# Altium schematic sheet Schematic1_1核心板.schdoc (part 2 of 3)
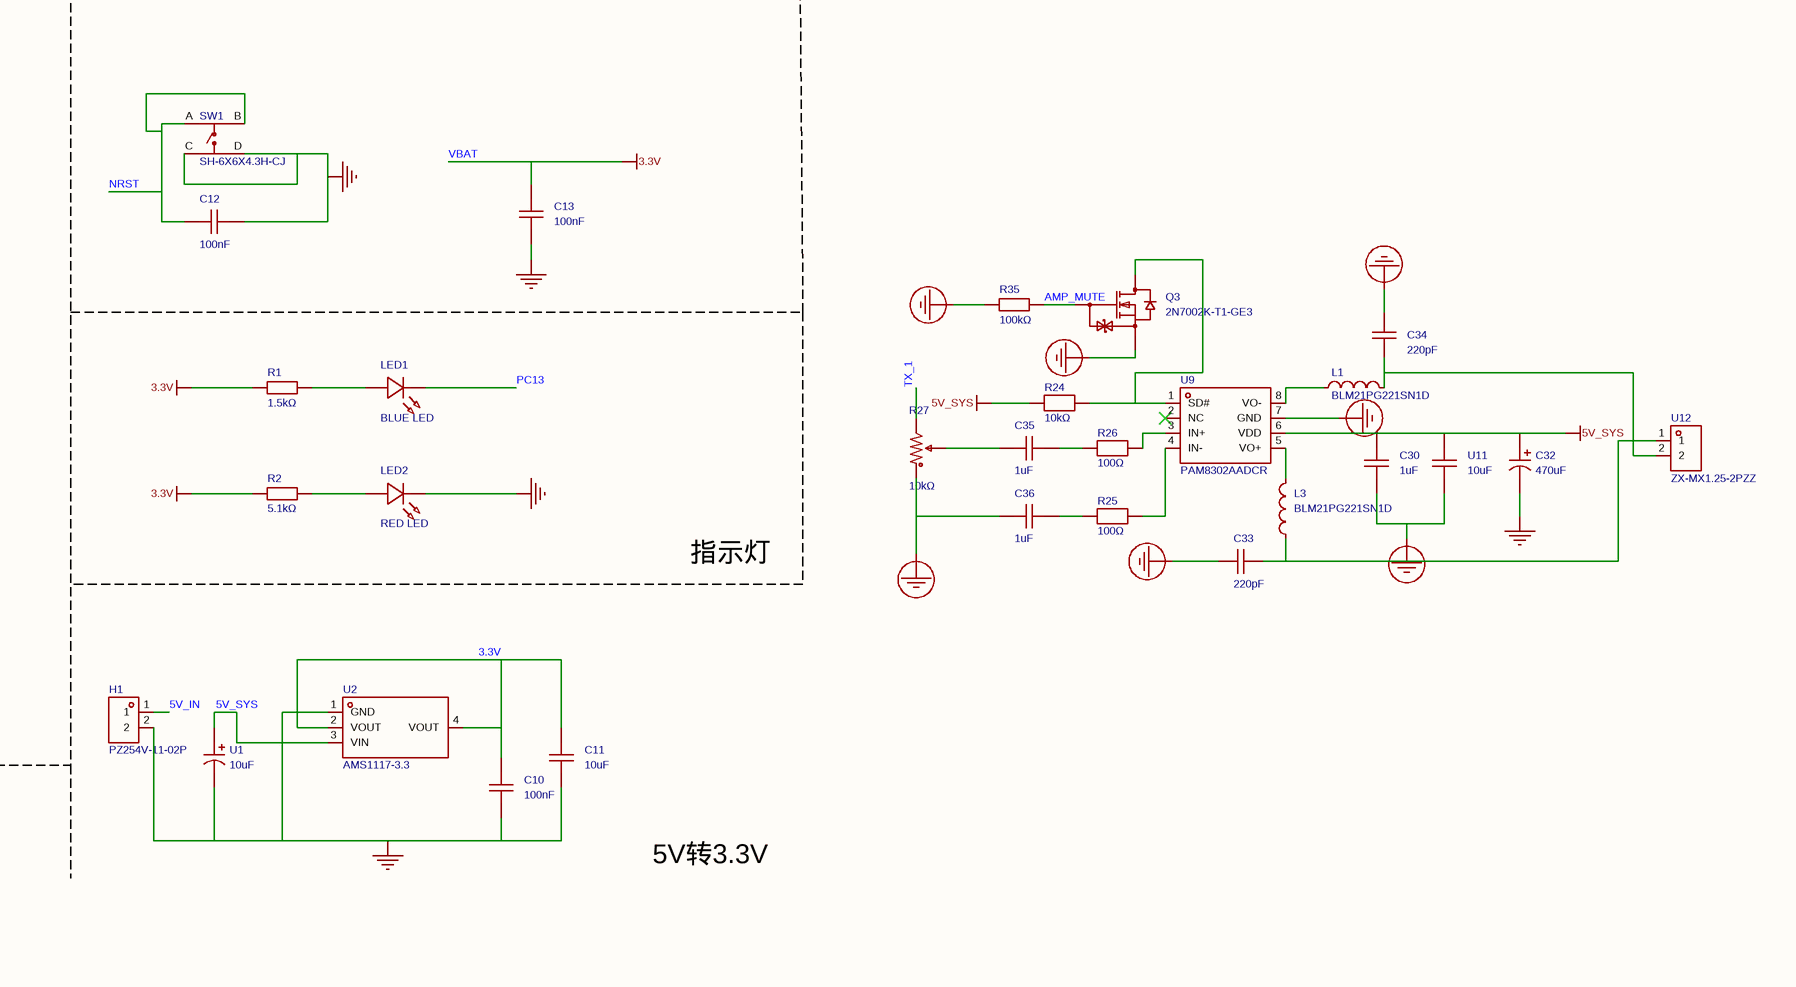
[diagram p4: Schematic1_1核心板.schdoc, bottom right]
## Library data of the parts
C0 C20 = CL21A475KAQNNNE: 容值:4.7uF;精度:±10%;额定电压:25V;温度系数:X5R;; Manufacturer: SAMSUNG(三星); AddInBom: yes; ModelId: 1ba041120af144c991958decab20d2410819f05c4eef4c71ace90d822a990e87; ModelName: C0805_L2.0-W1.3-H1.3; ModelTransform: 78.74,51.181,0,0,0,0,0,0.0005,0; Tolerance: ±10%; Voltage Rating: 25V; Temperature Coefficient: X5R; Symbol: CL21A475KAQNNNE; Device: CL21A475KAQNNNE; LCSC Part Name: 4.7uF ±10% 25V; SupplierPart: C1779; ManufacturerPart: CL21A475KAQNNNE; Supplier Footprint: 0805; JLCPCB Part Class: Basic Part; Datasheet: https://item.szlcsc.com/datasheet/CL21A475KAQNNNE/2131.html; Supplier: LCSC; ConvertToPcb: yes; FootprintName: C0805; Value: 4.7uF
C1 C2 = 0603CG8R0C500NT: 容值:8pF;额定电压:50V;温度系数:C0G;; Manufacturer: FH(风华); Symbol: 0603CG8R0C500NT_C36508; AddInBom: yes; ModelId: ac125912035d415993ca9572d50418b10819f05c4eef4c71ace90d822a990e87; ModelName: C0603_L1.6-W0.8-H0.8; ModelTransform: 62.992,31.496,0,0,0,0,0,0,0; Voltage Rating: 50V; Temperature Coefficient: C0G; Device: 0603CG8R0C500NT; LCSC Part Name: ±0.25pF 8pF 50V; SupplierPart: C36508; ManufacturerPart: 0603CG8R0C500NT; Supplier Footprint: 0603; JLCPCB Part Class: Extended Part; Datasheet: https://item.szlcsc.com/datasheet/0603CG8R0C500NT/37486.html; Supplier: LCSC; ConvertToPcb: yes; FootprintName: C0603; Value: 8pF
C3 = TAJB107K006RNJ: 容值:100uF;精度:±10%;额定电压:6.3V;等效串联电阻(ESR):1.7Ω@100kHz;; Manufacturer: Kyocera AVX; AddInBom: yes; ModelId: b77bd53aeda446d2bdd09b0fdaf9418a0819f05c4eef4c71ace90d822a990e87; ModelName: CASE-B_L3.5-W2.8-H1.9; ModelTransform: 145.669,110.236,0,0,0,0,0,0,0; Tolerance: ±10%; Voltage Rating: 6.3V; Symbol: TAJB107K006RNJ; Device: TAJB107K006RNJ; LCSC Part Name: 100uF ±10% 6.3V; SupplierPart: C16133; ManufacturerPart: TAJB107K006RNJ; Supplier Footprint: CASE-B-3528-21(mm); JLCPCB Part Class: Basic Part; Supplier: LCSC; ConvertToPcb: yes; FootprintName: CASE-B_3528; Value: 100uF; Equivalent Series Resistance(ESR): 1.7Ω@100kHz; Operating Temperature: -55℃~+125℃
C4-C7 C10 C12 C13 = CL21B104KBCNNNC: 容值:100nF;精度:±10%;额定电压:50V;温度系数:X7R;; Manufacturer: SAMSUNG(三星); AddInBom: yes; ModelId: 1ba041120af144c991958decab20d2410819f05c4eef4c71ace90d822a990e87; ModelName: C0805_L2.0-W1.3-H1.3; ModelTransform: 78.74,51.181,0,0,0,0,0,0.0005,0; Tolerance: ±10%; Voltage Rating: 50V; Temperature Coefficient: X7R; Symbol: CL21B104KBCNNNC; Device: CL21B104KBCNNNC; LCSC Part Name: 100nF ±10% 50V; SupplierPart: C1711; ManufacturerPart: CL21B104KBCNNNC; Supplier Footprint: 0805; JLCPCB Part Class: Extended Part; Datasheet: https://item.szlcsc.com/datasheet/CL21B104KBCNNNC/2063.html; Supplier: LCSC; ConvertToPcb: yes; FootprintName: C0805; Value: 100nF
C8 = CL21B105KAFNNNE: 容值:1uF;精度:±10%;额定电压:25V;温度系数:X7R;; Manufacturer: SAMSUNG(三星); AddInBom: yes; ModelId: 1ba041120af144c991958decab20d2410819f05c4eef4c71ace90d822a990e87; ModelName: C0805_L2.0-W1.3-H1.3; ModelTransform: 78.74,51.181,0,0,0,0,0,0.0005,0; Tolerance: ±10%; Voltage Rating: 25V; Temperature Coefficient: X7R; Symbol: CL21B105KAFNNNE; Device: CL21B105KAFNNNE; LCSC Part Name: 1uF ±10% 25V; SupplierPart: C116352; ManufacturerPart: CL21B105KAFNNNE; Supplier Footprint: 0805; JLCPCB Part Class: Extended Part; Datasheet: https://item.szlcsc.com/datasheet/CL21B105KAFNNNE/117606.html; Supplier: LCSC; ConvertToPcb: yes; FootprintName: C0805; Value: 1uF
C9 C21 = CL21B104KBCNNNC: 容值:100nF;精度:±10%;额定电压:50V;温度系数:X7R;; Manufacturer: SAMSUNG(三星); 3D Model: 1ba041120af144c991958decab20d2410819f05c4eef4c71ace90d822a990e87; 3D Model Transform: 78.74,51.181,0,0,0,0,0,0.0005,0; Tolerance: ±10%; Voltage Rating: 50V; Temperature Coefficient: X7R; AddInBom: yes; ModelName: C0805_L2.0-W1.3-H1.3; Symbol: CL21B104KBCNNNC; Device: CL21B104KBCNNNC; LCSC Part Name: 100nF ±10% 50V; Supplier Part: C1711; Manufacturer Part: CL21B104KBCNNNC; Supplier Footprint: 0805; JLCPCB Part Class: Extended Part; Datasheet: https://item.szlcsc.com/datasheet/CL21B104KBCNNNC/2063.html; Supplier: LCSC; Value: 100nF; ConvertToPcb: yes; FootprintName: C0805
C11 = CGA0805X5R106K500MT: 容值:10uF;精度:±10%;额定电压:50V;温度系数:X5R;; Manufacturer: HRE(芯声); AddInBom: yes; ModelId: 1ba041120af144c991958decab20d2410819f05c4eef4c71ace90d822a990e87; ModelName: C0805_L2.0-W1.3-H1.3; ModelTransform: 78.74,51.181,0,0,0,0,0,0.0005,0; Tolerance: ±10%; Voltage Rating: 50V; Temperature Coefficient: X5R; Symbol: CGA0805X5R106K500MT; Device: CGA0805X5R106K500MT; LCSC Part Name: 10uF ±10% 50V; SupplierPart: C6119889; ManufacturerPart: CGA0805X5R106K500MT; Supplier Footprint: 0805; JLCPCB Part Class: Extended Part; Datasheet: https://item.szlcsc.com/datasheet/CGA0805X5R106K500MT/7062595.html; Supplier: LCSC; ConvertToPcb: yes; FootprintName: C0805; Value: 10uF
C14 = CGA0805X7R105K500MT: 容值:1uF;精度:±10%;额定电压:50V;温度系数:X7R;; Manufacturer: HRE(芯声); AddInBom: yes; ModelId: 1ba041120af144c991958decab20d2410819f05c4eef4c71ace90d822a990e87; ModelName: C0805_L2.0-W1.3-H1.3; ModelTransform: 78.74,51.181,0,0,0,0,0,0.0005,0; Tolerance: ±10%; Voltage Rating: 50V; Temperature Coefficient: X7R; Symbol: CGA0805X7R105K500MT; Device: CGA0805X7R105K500MT; LCSC Part Name: 1uF ±10% 50V; SupplierPart: C6119929; ManufacturerPart: CGA0805X7R105K500MT; Supplier Footprint: 0805; JLCPCB Part Class: Extended Part; Datasheet: https://item.szlcsc.com/datasheet/CGA0805X7R105K500MT/7062635.html; Supplier: LCSC; ConvertToPcb: yes; FootprintName: C0805; Value: 1uF
C17 C24 C30 C35 C36 C40 = CGA0805X7R105K500MT: 容值:1uF;精度:±10%;额定电压:50V;温度系数:X7R;; Manufacturer: HRE(芯声); 3D Model: 1ba041120af144c991958decab20d2410819f05c4eef4c71ace90d822a990e87; 3D Model Transform: 78.74,51.181,0,0,0,0,0,0.0005,0; Tolerance: ±10%; Voltage Rating: 50V; Temperature Coefficient: X7R; AddInBom: yes; ModelName: C0805_L2.0-W1.3-H1.3; Symbol: CGA0805X7R105K500MT; Device: CGA0805X7R105K500MT; LCSC Part Name: 1uF ±10% 50V; Manufacturer Part: CGA0805X7R105K500MT; Supplier Footprint: 0805; JLCPCB Part Class: Extended Part; Datasheet: https://item.szlcsc.com/datasheet/CGA0805X7R105K500MT/7062635.html; Supplier: LCSC; ConvertToPcb: yes; FootprintName: C0805
  C17 C30 C35 C36 C40: Supplier Part: C6119929; Value: 1uF
  C24: Value: 2.2uF
C18 C19 C25 C26 C29 = TCC0805X7R104K500DT: 容值:100nF;精度:±10%;额定电压:50V;温度系数:X7R;; Manufacturer: CCTC(三环); AddInBom: yes; ModelId: 1ba041120af144c991958decab20d2410819f05c4eef4c71ace90d822a990e87; ModelName: C0805_L2.0-W1.3-H1.3; ModelTransform: 78.74,51.181,0,0,0,0,0,0.0005,0; Tolerance: ±10%; Voltage Rating: 50V; Temperature Coefficient: X7R; Symbol: TCC0805X7R104K500DT; Device: TCC0805X7R104K500DT; LCSC Part Name: 100nF ±10% 50V; SupplierPart: C282732; ManufacturerPart: TCC0805X7R104K500DT; Supplier Footprint: 0805; JLCPCB Part Class: Extended Part; Datasheet: https://item.szlcsc.com/datasheet/TCC0805X7R104K500DT/268703.html; Supplier: LCSC; ConvertToPcb: yes; FootprintName: C0805; Value: 100nF
C22 = CL21C222JBFNNNE: 容值:2.2nF;精度:±5%;额定电压:50V;温度系数:C0G;; Manufacturer: SAMSUNG(三星); AddInBom: yes; ModelId: 1ba041120af144c991958decab20d2410819f05c4eef4c71ace90d822a990e87; ModelName: C0805_L2.0-W1.3-H1.3; ModelTransform: 78.74,51.181,0,0,0,0,0,0.0005,0; Tolerance: ±5%; Voltage Rating: 50V; Temperature Coefficient: C0G; Symbol: CL21C222JBFNNNE; Device: CL21C222JBFNNNE; LCSC Part Name: 2.2nF ±5% 50V; SupplierPart: C28260; ManufacturerPart: CL21C222JBFNNNE; Supplier Footprint: 0805; JLCPCB Part Class: Basic Part; Datasheet: https://item.szlcsc.com/datasheet/CL21C222JBFNNNE/29010.html; Supplier: LCSC; ConvertToPcb: yes; FootprintName: C0805; Value: 2.2nF
C23 = CC0805KRX7R9BB102: 容值:1nF;精度:±10%;额定电压:50V;温度系数:X7R;; Manufacturer: YAGEO(国巨); AddInBom: yes; ModelId: 1ba041120af144c991958decab20d2410819f05c4eef4c71ace90d822a990e87; ModelName: C0805_L2.0-W1.3-H1.3; ModelTransform: 78.74,51.181,0,0,0,0,0,0.0005,0; Tolerance: ±10%; Voltage Rating: 50V; Temperature Coefficient: X7R; Symbol: CC0805KRX7R9BB102; Device: CC0805KRX7R9BB102; LCSC Part Name: 1nF ±10% 50V; SupplierPart: C94121; ManufacturerPart: CC0805KRX7R9BB102; Supplier Footprint: 0805; JLCPCB Part Class: Extended Part; Datasheet: https://item.szlcsc.com/datasheet/CC0805KRX7R9BB102/95319.html; Supplier: LCSC; ConvertToPcb: yes; FootprintName: C0805; Value: 1nF
C27 = CL21B225KAFNNNE: 容值:2.2uF;精度:±10%;额定电压:25V;温度系数:X7R;; Manufacturer: SAMSUNG(三星); AddInBom: yes; ModelId: 1ba041120af144c991958decab20d2410819f05c4eef4c71ace90d822a990e87; ModelName: C0805_L2.0-W1.3-H1.3; ModelTransform: 78.74,51.181,0,0,0,0,0,0.0005,0; Tolerance: ±10%; Voltage Rating: 25V; Temperature Coefficient: X7R; Symbol: CL21B225KAFNNNE; Device: CL21B225KAFNNNE; LCSC Part Name: 2.2uF ±10% 25V; SupplierPart: C19110; ManufacturerPart: CL21B225KAFNNNE; Supplier Footprint: 0805; JLCPCB Part Class: Extended Part; Datasheet: https://item.szlcsc.com/datasheet/CL21B225KAFNNNE/19814.html; Supplier: LCSC; ConvertToPcb: yes; FootprintName: C0805; Value: 2.2uF
C28 = CL21A106KOQNNNE: 容值:10uF;精度:±10%;额定电压:16V;温度系数:X5R;; Manufacturer: SAMSUNG(三星); AddInBom: yes; ModelId: 1ba041120af144c991958decab20d2410819f05c4eef4c71ace90d822a990e87; ModelName: C0805_L2.0-W1.3-H1.3; ModelTransform: 78.74,51.181,0,0,0,0,0,0.0005,0; Tolerance: ±10%; Voltage Rating: 16V; Temperature Coefficient: X5R; Symbol: CL21A106KOQNNNE; Device: CL21A106KOQNNNE; LCSC Part Name: 10uF ±10% 16V; SupplierPart: C1713; ManufacturerPart: CL21A106KOQNNNE; Supplier Footprint: 0805; JLCPCB Part Class: Extended Part; Datasheet: https://item.szlcsc.com/datasheet/CL21A106KOQNNNE/2065.html; Supplier: LCSC; ConvertToPcb: yes; FootprintName: C0805; Value: 10uF
C32 = ERG35V470M10X13: 容值:470uF;精度:±20%;额定电压:35V;纹波电流:1.23A@100kHz;等效串联电阻(ESR):46mΩ@100kHz;; Manufacturer: JIERR(捷而瑞); AddInBom: yes; ModelId: e69a8877034041adb17289105fbfdf3e0819f05c4eef4c71ace90d822a990e87; ModelTransform: 394.094,393.211,0,0,0,0,-0.005,0,-137.795; Tolerance: ±20%; Voltage Rating: 35V; Pin Spacing: 5mm; Lifetime: 2000hrs@105℃; Symbol: ERG35V470M10X13; Device: ERG35V470M10X13; LCSC Part Name: 470uF ±20% 35V; SupplierPart: C47344180; ManufacturerPart: ERG35V470M10X13; Supplier Footprint: 插件,D10xL13mm; JLCPCB Part Class: Extended Part; Datasheet: https://item.szlcsc.com/datasheet/ERG35V470M10X13/49556621.html; Supplier: LCSC; ConvertToPcb: yes; FootprintName: CAP-TH_BD10.0-P5.00-D0.6-FD; ModelName: CAP-TH_BD10.0-P5.00-D0.6-FD; Value: 470uF; Ripple Current: 1.23A@100kHz; Equivalent Series Resistance(ESR): 46mΩ@100kHz; Diameter: 10mm; Height - Seated (Max): 13mm; Operating Temperature: -40℃~+105℃
C33 C34 = CC0805KRX7R9BB221: 容值:220pF;精度:±10%;额定电压:50V;温度系数:X7R;; Manufacturer: YAGEO(国巨); AddInBom: yes; ModelId: 1ba041120af144c991958decab20d2410819f05c4eef4c71ace90d822a990e87; ModelName: C0805_L2.0-W1.3-H1.3; ModelTransform: 78.74,51.181,0,0,0,0,0,0.0005,0; Tolerance: ±10%; Voltage Rating: 50V; Temperature Coefficient: X7R; Symbol: CC0805KRX7R9BB221; Device: CC0805KRX7R9BB221; LCSC Part Name: 220pF ±10% 50V; SupplierPart: C107145; ManufacturerPart: CC0805KRX7R9BB221; Supplier Footprint: 0805; JLCPCB Part Class: Basic Part; Datasheet: https://item.szlcsc.com/datasheet/CC0805KRX7R9BB221/108361.html; Supplier: LCSC; ConvertToPcb: yes; FootprintName: C0805; Value: 220pF
C37 C38 = CC0805KRX7R9BB182: 容值:1.8nF;精度:±10%;额定电压:50V;温度系数:X7R;; Manufacturer: YAGEO(国巨); AddInBom: yes; ModelId: 1ba041120af144c991958decab20d2410819f05c4eef4c71ace90d822a990e87; ModelName: C0805_L2.0-W1.3-H1.3; ModelTransform: 78.74,51.181,0,0,0,0,0,0.0005,0; Tolerance: ±10%; Voltage Rating: 50V; Temperature Coefficient: X7R; Symbol: CC0805KRX7R9BB182; Device: CC0805KRX7R9BB182; LCSC Part Name: 1.8nF ±10% 50V; SupplierPart: C277524; ManufacturerPart: CC0805KRX7R9BB182; Supplier Footprint: 0805; JLCPCB Part Class: Extended Part; Datasheet: https://item.szlcsc.com/datasheet/CC0805KRX7R9BB182/264843.html; Supplier: LCSC; ConvertToPcb: yes; FootprintName: C0805; Value: 1.8nF
C41 = CL21C222JBFNNNE: 容值:2.2nF;精度:±5%;额定电压:50V;温度系数:C0G;; Manufacturer: SAMSUNG(三星); 3D Model: 1ba041120af144c991958decab20d2410819f05c4eef4c71ace90d822a990e87; 3D Model Transform: 78.74,51.181,0,0,0,0,0,0.0005,0; Tolerance: ±5%; Voltage Rating: 50V; Temperature Coefficient: C0G; AddInBom: yes; ModelName: C0805_L2.0-W1.3-H1.3; Symbol: CL21C222JBFNNNE; Device: CL21C222JBFNNNE; LCSC Part Name: 2.2nF ±5% 50V; Supplier Part: C28260; Manufacturer Part: CL21C222JBFNNNE; Supplier Footprint: 0805; JLCPCB Part Class: Basic Part; Datasheet: https://item.szlcsc.com/datasheet/CL21C222JBFNNNE/29010.html; Supplier: LCSC; Value: 2.2nF; ConvertToPcb: yes; FootprintName: C0805
C42 = TCC0805X7R104K500DT: 容值:100nF;精度:±10%;额定电压:50V;温度系数:X7R;; Manufacturer: CCTC(三环); 3D Model: 1ba041120af144c991958decab20d2410819f05c4eef4c71ace90d822a990e87; 3D Model Transform: 78.74,51.181,0,0,0,0,0,0.0005,0; Tolerance: ±10%; Voltage Rating: 50V; Temperature Coefficient: X7R; AddInBom: yes; ModelName: C0805_L2.0-W1.3-H1.3; Symbol: TCC0805X7R104K500DT; Device: TCC0805X7R104K500DT; LCSC Part Name: 100nF ±10% 50V; Supplier Part: C282732; Manufacturer Part: TCC0805X7R104K500DT; Supplier Footprint: 0805; JLCPCB Part Class: Extended Part; Datasheet: https://item.szlcsc.com/datasheet/TCC0805X7R104K500DT/268703.html; Supplier: LCSC; Value: 100nF; ConvertToPcb: yes; FootprintName: C0805
D1 = SS14_C7420316: 二极管配置:独立式;正向压降(Vf):550mV@1.0A;直流反向耐压(Vr):40V;整流电流:1A;; Manufacturer: R+O(宏嘉诚); AddInBom: yes; ModelId: 7e24bebe6cd74171ae8c9de6fc5b78aa0819f05c4eef4c71ace90d822a990e87; ModelTransform: 198.4248,103.5431,0,180,0,0,-0.001,0,0; Diode Configuration: 独立式; Voltage - DC Reverse(Vr): 40V; Current - Rectified: 1A; Reverse Leakage Current (Ir): 200uA@40V; Operating Junction Temperature Range: -55℃~+150℃; Non-Repetitive Peak Forward Surge Current: 30A; Symbol: SS14_C7420316; Device: SS14_C7420316; LCSC Part Name: 电压:40V 电流:1A; SupplierPart: C7420316; ManufacturerPart: SS14; Supplier Footprint: SMA(DO-214AC); JLCPCB Part Class: Extended Part; Datasheet: https://item.szlcsc.com/datasheet/SS14/8397138.html; Supplier: LCSC; ConvertToPcb: yes; FootprintName: SMA_L4.3-W2.6-LS5.0-FD; ModelName: SMA_L4.3-W2.6-LS5.0-FD; Voltage - Forward(Vf@If): 550mV@1.0A
D2 = B5817W_C7420328: 二极管配置:独立式;正向压降(Vf):450mV@1.0A;直流反向耐压(Vr):20V;整流电流:1A;; Manufacturer: R+O(宏嘉诚); AddInBom: yes; ModelId: 5054d9b7be8b429dad093a54b517b4dd0819f05c4eef4c71ace90d822a990e87; ModelTransform: 145.669,61.024,0,0,0,0,0,0,0; Diode Configuration: 独立式; Voltage - DC Reverse(Vr): 20V; Current - Rectified: 1A; Reverse Leakage Current (Ir): 1mA@20V; Operating Junction Temperature Range: -55℃~+150℃; Symbol: B5817W_C7420328; Device: B5817W_C7420328; LCSC Part Name: 电压:20V 电流:1A; SupplierPart: C7420328; ManufacturerPart: B5817W; Supplier Footprint: SOD-123; JLCPCB Part Class: Extended Part; Datasheet: https://item.szlcsc.com/datasheet/B5817W/8397150.html; Supplier: LCSC; ConvertToPcb: yes; FootprintName: SOD-123_L2.7-W1.6-LS3.7-FD; ModelName: SOD-123_L2.7-W1.6-LS3.7-FD; Voltage - Forward(Vf@If): 450mV@1.0A
H1 = PZ254V-11-02P: 插针结构:1x2P;间距:2.54mm;行距:-;圆针/方针:方针;安装方式:直插;排数:单排;总PIN位数:2P;额定电流:3A;额定电压:250V;配合针长度:6mm;塑高:2.5mm;端接针长度:3mm;触头材质:黄铜;触头镀层:-;工作温度:-40℃~+105℃;颜色:黑色;; Manufacturer: XFCN(兴飞); AddInBom: yes; ModelId: e35305ec3aa84b66b849f914b715e73f0819f05c4eef4c71ace90d822a990e87; ModelName: HDR2.54-M-LI-1X2P; ModelTransform: 200,100,0,0,0,0,0,0,-118.11; Pin Structure: 1x2P; Pitch: 2.54mm; Circluar Pins/Square Pins: 方针; Current Rating: 3A; Voltage Rating (Max): 250V; Symbol: PZ254V-11-02P; Device: PZ254V-11-02P; LCSC Part Name: 1x2P 间距:2.54mm 方针 直插; SupplierPart: C492401; ManufacturerPart: PZ254V-11-02P; Supplier Footprint: 插件,P=2.54mm; JLCPCB Part Class: Extended Part; Datasheet: https://item.szlcsc.com/datasheet/PZ254V-11-02P/502957.html; Supplier: LCSC; ConvertToPcb: yes; FootprintName: HDR-TH_2P-P2.54-V-M; Row Spacing: -; Mounting Type: 直插; Number of Rows: 单排; Number of Pins: 2P; Length of Mating Pin: 6mm; Insulation Height: 2.5mm; Length of End Connection Pin: 3mm; Contact Material: 黄铜; Contact Plating: -; Operating Temperature: -40℃~+105℃; Color: 黑色
H2 = PZ254V-11-04P: 插针结构:1x4P;间距:2.54mm;行距:-;圆针/方针:方针;安装方式:直插;排数:单排;总PIN位数:4P;额定电流:3A;额定电压:250V;配合针长度:6mm;塑高:2.5mm;端接针长度:3mm;触头材质:-;工作温度:-40℃~+105℃;颜色:黑色;; Manufacturer: XFCN(兴飞); Symbol: PZ254V-11-04P_C2691448; AddInBom: yes; ModelId: 112f4d05e8d64e99ab9a333894bea4f90819f05c4eef4c71ace90d822a990e87; ModelName: HDR-TH_4P-P2.54-M-LI-1X4P; ModelTransform: 399.999,104.7242,0,0,0,0,0,0,-118.11; Pin Structure: 1x4P; Pitch: 2.54mm; Circluar Pins/Square Pins: 方针; Current Rating: 3A; Voltage Rating (Max): 250V; Device: PZ254V-11-04P; LCSC Part Name: 1x4P 间距:2.54mm 方针 直插; SupplierPart: C2691448; ManufacturerPart: PZ254V-11-04P; Supplier Footprint: 插件,P=2.54mm; JLCPCB Part Class: Extended Part; Datasheet: https://item.szlcsc.com/datasheet/PZ254V-11-04P/2801085.html; Supplier: LCSC; ConvertToPcb: yes; FootprintName: HDR-TH_4P-P2.54-V-M; Row Spacing: -; Mounting Type: 直插; Number of Rows: 单排; Number of Pins: 4P; Length of Mating Pin: 6mm; Insulation Height: 2.5mm; Length of End Connection Pin: 3mm; Contact Material: -; Operating Temperature: -40℃~+105℃; Color: 黑色
H3 = PM254V-11-04-H85: 插孔结构:1x4P;间距:2.54mm;行距:-;圆孔/方孔:方孔;安装方式:直插;排数:单排;总孔位数:4P;额定电流:3A;插孔方向:顶部;塑高:8.5mm;触头材质:黄铜;触头镀层:-;工作温度:-40℃~+105℃;; Manufacturer: XFCN(兴飞); AddInBom: yes; ModelId: d187812051054f85879fcaa51a310d8e0819f05c4eef4c71ace90d822a990e87; ModelTransform: 419.6842,98.464,0,0,0,0,0,0,-118.11; Holes Structure: 1x4P; Pitch: 2.54mm; Circular Hole / Square Hole: 方孔; Number of Positions: 4P; Current Rating: 3A; Holes Direction: 顶部; Symbol: PM254V-11-04-H85; Device: PM254V-11-04-H85; LCSC Part Name: 1x4P 间距:2.54mm 直插; SupplierPart: C541851; ManufacturerPart: PM254V-11-04-H85; Supplier Footprint: 插件,P=2.54mm; JLCPCB Part Class: Extended Part; Datasheet: https://item.szlcsc.com/datasheet/PM254V-11-04-H85/562472.html; Supplier: LCSC; ConvertToPcb: yes; FootprintName: HDR-TH_4P-P2.54-V-F; ModelName: HDR-TH_4P-P2.54-V-F; Row Spacing: -; Mounting Type: 直插; Number of Rows: 单排; Insulation Height: 8.5mm; Contact Material: 黄铜; Contact Plating: -; Operating Temperature: -40℃~+105℃
H4 H5 H10 = PZ254V-11-04P: 插针结构:1x4P;间距:2.54mm;行距:-;圆针/方针:方针;安装方式:直插;排数:单排;总PIN位数:4P;额定电流:3A;额定电压:250V;配合针长度:6mm;塑高:2.5mm;端接针长度:3mm;触头材质:-;工作温度:-40℃~+105℃;颜色:黑色;; Manufacturer: XFCN(兴飞); Symbol: PZ254V-11-04P_C2691448; 3D Model: 112f4d05e8d64e99ab9a333894bea4f90819f05c4eef4c71ace90d822a990e87; 3D Model Transform: 399.999,104.7242,0,0,0,0,0,0,-118.11; Pin Structure: 1x4P; Pitch: 2.54mm; Circluar Pins/Square Pins: 方针; Current Rating: 3A; Voltage Rating (Max): 250V; AddInBom: yes; ModelName: HDR-TH_4P-P2.54-M-LI-1X4P; Device: PZ254V-11-04P; LCSC Part Name: 1x4P 间距:2.54mm 方针 直插; Supplier Part: C2691448; Manufacturer Part: PZ254V-11-04P; Supplier Footprint: 插件,P=2.54mm; JLCPCB Part Class: Extended Part; Datasheet: https://item.szlcsc.com/datasheet/PZ254V-11-04P/2801085.html; Supplier: LCSC; Row Spacing: -; Mounting Type: 直插; Number of Rows: 单排; Number of Pins: 4P; Length of Mating Pin: 6mm; Insulation Height: 2.5mm; Length of End Connection Pin: 3mm; Contact Material: -; Operating Temperature: -40℃~+105℃; Color: 黑色; ConvertToPcb: yes; FootprintName: HDR-TH_4P-P2.54-V-M
H6-H9 = PZ254V-11-02P: 插针结构:1x2P;间距:2.54mm;行距:-;圆针/方针:方针;安装方式:直插;排数:单排;总PIN位数:2P;额定电流:3A;额定电压:250V;配合针长度:6mm;塑高:2.5mm;端接针长度:3mm;触头材质:黄铜;触头镀层:-;工作温度:-40℃~+105℃;颜色:黑色;; Manufacturer: XFCN(兴飞); 3D Model: e35305ec3aa84b66b849f914b715e73f0819f05c4eef4c71ace90d822a990e87; 3D Model Transform: 200,100,0,0,0,0,0,0,-118.11; Pin Structure: 1x2P; Pitch: 2.54mm; Circluar Pins/Square Pins: 方针; Current Rating: 3A; Voltage Rating (Max): 250V; AddInBom: yes; ModelName: HDR2.54-M-LI-1X2P; Symbol: PZ254V-11-02P; Device: PZ254V-11-02P; LCSC Part Name: 1x2P 间距:2.54mm 方针 直插; Supplier Part: C492401; Manufacturer Part: PZ254V-11-02P; Supplier Footprint: 插件,P=2.54mm; JLCPCB Part Class: Extended Part; Datasheet: https://item.szlcsc.com/datasheet/PZ254V-11-02P/502957.html; Supplier: LCSC; Row Spacing: -; Mounting Type: 直插; Number of Rows: 单排; Number of Pins: 2P; Length of Mating Pin: 6mm; Insulation Height: 2.5mm; Length of End Connection Pin: 3mm; Contact Material: 黄铜; Contact Plating: -; Operating Temperature: -40℃~+105℃; Color: 黑色; ConvertToPcb: yes; FootprintName: HDR-TH_2P-P2.54-V-M
L1 L3 = BLM21PG221SN1D: 阻抗@频率:220Ω@100MHz;误差:±25%;直流电阻(DCR):45mΩ;; Manufacturer: muRata(村田); AddInBom: yes; ModelId: 37a81e68749a4138bd2dfa6897b24b850819f05c4eef4c71ace90d822a990e87; ModelName: R0805_L2.0-W1.3-H0.6; ModelTransform: 78.74,51.181,0,0,0,0,0,0.001,0; Tolerance: ±25%; DC Resistance(DCR): 45mΩ; Current Rating: 2A; Number of Circuits: 1; Symbol: BLM21PG221SN1D; Device: BLM21PG221SN1D; LCSC Part Name: 单路 0805磁珠 阻抗220Ω@100MHz; SupplierPart: C85840; ManufacturerPart: BLM21PG221SN1D; Supplier Footprint: 0805; JLCPCB Part Class: Extended Part; Datasheet: https://item.szlcsc.com/datasheet/BLM21PG221SN1D/87016.html; Supplier: LCSC; ConvertToPcb: yes; FootprintName: L0805; Impedance @ Frequency: 220Ω@100MHz; Operating Temperature: -55℃~+125℃
L2 = CBW201209U102T: 阻抗@频率:1kΩ@100MHz;误差:±25%;直流电阻(DCR):250mΩ;; Manufacturer: FH(风华); 3D Model: 37a81e68749a4138bd2dfa6897b24b850819f05c4eef4c71ace90d822a990e87; 3D Model Transform: 78.74,51.181,0,0,0,0,0,0.001,0; Tolerance: ±25%; DC Resistance(DCR): 250mΩ; Current Rating: 1A; Number of Circuits: 1; AddInBom: yes; ModelName: R0805_L2.0-W1.3-H0.6; Symbol: CBW201209U102T; Device: CBW201209U102T; LCSC Part Name: 单路 0805磁珠 阻抗1kΩ@100MHz; Supplier Part: C44838; Manufacturer Part: CBW201209U102T; Supplier Footprint: 0805; JLCPCB Part Class: Extended Part; Datasheet: https://item.szlcsc.com/datasheet/CBW201209U102T/45840.html; Supplier: LCSC; Impedance @ Frequency: 1kΩ@100MHz; Operating Temperature: -40℃~+85℃; ConvertToPcb: yes; FootprintName: L0805
LED1 = GL0805UB01: 灯头类型:2mmx1.25mm方形灯头;发光颜色:蓝色;正向压降(Vf):3.1V;功率:-;正向电流:20mA；5mA;波长:457nm~475nm;二极管配置:独立二极管;透镜颜色:无色透明透镜;色温:-;发光强度:80mcd;发光角度:120°;载带方式:正贴;工作温度:-40℃~+85℃;; Manufacturer: Guiguang light(桂光光电); AddInBom: yes; ModelId: 6ccd75a2b5134d6ab756ecf3c14a72900819f05c4eef4c71ace90d822a990e87; ModelName: LED0805-RD; ModelTransform: 79.527,49.2125,0,0,0,0,0,0,0; Illumination Color: 蓝色; Voltage - Forward(Vf): 3.1V; Diode Configuration: 独立二极管; Lens Color: 无色透明透镜; Luminous Intensity: 80mcd; Viewing Angle: 120°; Symbol: GL0805UB01; Device: GL0805UB01; Manufacturer Part: BLUE LED; LCSC Part Name: 0805 蓝灯 高亮; SupplierPart: C51933309; Supplier Footprint: 0805; JLCPCB Part Class: Extended Part; Datasheet: https://item.szlcsc.com/datasheet/GL0805UB01/54646005.html; Supplier: LCSC; ConvertToPcb: yes; FootprintName: LED0805-RD_BLUE; Lamp Holder Type: 2mmx1.25mm方形灯头; Power(Watts): -; Forward Current: 20mA；5mA; Wavelength - Dominant: 457nm~475nm; Peak Wavelength: -; Color Temperature: -; Mounting Style: 正贴; Operating Temperature: -40℃~+85℃
LED2 = GL0805UR01: 灯头类型:2mmx1.25mm方形灯头;发光颜色:红色;正向压降(Vf):2.1V;功率:-;正向电流:20mA;波长:618nm~624nm;二极管配置:独立二极管;透镜颜色:无色透明透镜;色温:-;发光强度:100mcd;发光角度:120°;载带方式:正贴;工作温度:-40℃~+85℃;; Manufacturer: Guiguang light(桂光光电); AddInBom: yes; ModelId: f010e90d36544999ab4e363fdba5b4900819f05c4eef4c71ace90d822a990e87; ModelTransform: 78.74,49.21644,0,0,0,0,0,0,0; Illumination Color: 红色; Voltage - Forward(Vf): 2.1V; Forward Current: 20mA; Diode Configuration: 独立二极管; Lens Color: 无色透明透镜; Luminous Intensity: 100mcd; Viewing Angle: 120°; Symbol: GL0805UR01; Device: GL0805UR01; Manufacturer Part: RED LED; LCSC Part Name: 0805 红灯 高亮; SupplierPart: C51933307; Supplier Footprint: 0805; JLCPCB Part Class: Extended Part; Datasheet: https://item.szlcsc.com/datasheet/GL0805UR01/54646003.html; Supplier: LCSC; ConvertToPcb: yes; FootprintName: LED0805-R-RD_RED; ModelName: LED0805-R-RD_RED; Lamp Holder Type: 2mmx1.25mm方形灯头; Power(Watts): -; Wavelength - Dominant: 618nm~624nm; Peak Wavelength: -; Color Temperature: -; Mounting Style: 正贴; Operating Temperature: -40℃~+85℃
MIC1 = GMI9745P-56DB: Manufacturer: INGHAi(赢海); AddInBom: yes; ModelId: 3e6ff5061b6a4269a617fff4b67fdade0819f05c4eef4c71ace90d822a990e87; ModelTransform: 381.889,381.13538,0,0,0,0,0,79.016,-118.11; Symbol: GMI9745P-56DB; Device: GMI9745P-56DB; LCSC Part Name: 全指向φ9.7*4.5mm 1.5V-10V 灵敏度-56db 低阻抗 针脚; SupplierPart: C233968; ManufacturerPart: GMI9745P-56DB; Supplier Footprint: 插件,D=9.7mm; JLCPCB Part Class: Extended Part; Datasheet: https://atta.szlcsc.com/upload/public/pdf/source/20200109/C233968_5291F96EE0467CF4FC2CCAB1D42F17C3.pdf; Supplier: LCSC; ConvertToPcb: yes; FootprintName: MIC-TH_BD9.7-P2.54-D0.8-L-FD; ModelName: MIC-TH_BD9.7-P2.54-D0.8-L-FD
Q1 = AO3401A_C347476: 数量:1个P沟道;漏源电压(Vdss):30V;连续漏极电流(Id):4.2A;导通电阻(RDS(on)):50mΩ@10V;耗散功率(Pd):1.4W;阈值电压(Vgs(th)):1.3V@250uA;; Manufacturer: UMW(友台半导体); AddInBom: yes; ModelId: c62791f0466c4ae2a892c056b845b0ca0819f05c4eef4c71ace90d822a990e87; ModelName: SOT-23-3P_L2.9-W1.3-H1.0-LS2.4-P0.95; ModelTransform: 98.64468,114.173,0,180,0,0,0.001,-0.002,0; Number: 1个P沟道; Drain to Source Voltage: 30V; Current - Continuous Drain(Id): 4.2A; Pd - Power Dissipation: 1.4W; Gate Charge(Qg): 9.4nC@4.5V; Input Capacitance(Ciss): 954pF; Reverse Transfer Capacitance (Crss@Vds): 77pF; Type: P沟道; Output Capacitance(Coss): 115pF; Symbol: AO3401A_C347476; Device: AO3401A_C347476; LCSC Part Name: 1个P沟道 耐压:30V 电流:4.2A; SupplierPart: C347476; ManufacturerPart: AO3401A; Supplier Footprint: SOT-23; JLCPCB Part Class: Extended Part; Datasheet: https://item.szlcsc.com/datasheet/AO3401A/324136.html; Supplier: LCSC; ConvertToPcb: yes; FootprintName: SOT-23_L2.9-W1.3-P1.90-LS2.4-BR; RDS(on): 50mΩ@10V; Gate Threshold Voltage (Vgs(th)): 1.3V@250uA; Operating Temperature: -55℃~+150℃
Q2 = S8050_C20069125: 晶体管类型:NPN;集电极电流(Ic):500mA;集射极击穿电压(Vceo):25V;耗散功率(Pd):300mW;直流电流增益(hFE):120@50mA,1.0V;; Manufacturer: R+O(宏嘉诚); AddInBom: yes; ModelId: 5504beb8757f4de79731898ec55d3e540819f05c4eef4c71ace90d822a990e87; ModelTransform: 114.173,90.551,0,90,0,0,0,0,0; type: NPN; Current - Collector(Ic): 500mA; Collector - Emitter Voltage VCEO: 25V; Pd - Power Dissipation: 300mW; Transition frequency(fT): 100MHz; Current - Collector Cutoff: 100nA; Vce Saturation(VCE(sat)): 600mV@500mA,50mA; Emitter-Base Voltage(Vebo): 5V; Symbol: S8050_C20069125; Device: S8050_C20069125; LCSC Part Name: hFE:200-350，丝印:J3Y NPN 500mA 25V; SupplierPart: C20069125; ManufacturerPart: S8050; Supplier Footprint: SOT-23; JLCPCB Part Class: Extended Part; Datasheet: https://item.szlcsc.com/datasheet/S8050/21397163.html; Supplier: LCSC; ConvertToPcb: yes; FootprintName: SOT-23-3_L2.9-W1.3-P1.90-LS2.3-BR; ModelName: SOT-23-3_L2.9-W1.3-P1.90-LS2.3-BR; DC Current Gain: 120@50mA,1.0V; Operating Temperature: -55℃~+150℃
Q3 = 2N7002K-T1-GE3: 数量:1个N沟道;漏源电压(Vdss):60V;连续漏极电流(Id):300mA;导通电阻(RDS(on)):2Ω@10V,500mA;耗散功率(Pd):350mW;阈值电压(Vgs(th)):2.5V;; Manufacturer: VISHAY(威世); AddInBom: yes; ModelId: 89cb27a44ab2466697082bb9fd73a7d00819f05c4eef4c71ace90d822a990e87; ModelName: SOT-23-3L_L2.9-W1.6-H1.1-LS2.8-P0.95; ModelTransform: 114.173,110.236,0,90,0,0,0,0,0; Number: 1个N沟道; Drain to Source Voltage: 60V; Current - Continuous Drain(Id): 300mA; Pd - Power Dissipation: 350mW; Gate Threshold Voltage (Vgs(th)): 2.5V; Gate Charge(Qg): 600pC@10V; Reverse Transfer Capacitance (Crss@Vds): 2.5pF@10V; Symbol: 2N7002K-T1-GE3; Device: 2N7002K-T1-GE3; LCSC Part Name: 1个N沟道 耐压:60V 电流:300mA; SupplierPart: C81445; ManufacturerPart: 2N7002K-T1-GE3; Supplier Footprint: SOT-23; JLCPCB Part Class: Extended Part; Datasheet: https://item.szlcsc.com/datasheet/2N7002K-T1-GE3/82596.html; Supplier: LCSC; ConvertToPcb: yes; FootprintName: SOT-23-3_L2.9-W1.6-P1.90-LS2.8-BR; RDS(on): 2Ω@10V,500mA; Input Capacitance(Ciss): -; Operating Temperature: -55℃~+150℃
R1 = 0805W8F1501T5E: 电阻类型:厚膜电阻;阻值:1.5kΩ;精度:±1%;功率:125mW;最大工作电压:150V;温度系数:±100ppm/℃;; Manufacturer: UNI-ROYAL(厚声); AddInBom: yes; ModelId: 37a81e68749a4138bd2dfa6897b24b850819f05c4eef4c71ace90d822a990e87; ModelName: R0805_L2.0-W1.3-H0.6; ModelTransform: 78.74,51.181,0,0,0,0,0,-0.0005,0; Tolerance: ±1%; Power(Watts): 125mW; Overload Voltage (Max): 150V; Symbol: 0805W8F1501T5E; Device: 0805W8F1501T5E; LCSC Part Name: 1.5kΩ ±1% 125mW 厚膜电阻; SupplierPart: C4310; ManufacturerPart: 0805W8F1501T5E; Supplier Footprint: 0805; JLCPCB Part Class: Basic Part; Datasheet: https://atta.szlcsc.com/upload/public/pdf/source/20200306/C422600_1E6D84923E4A46A82E41ADD87F860B5C.pdf; Supplier: LCSC; ConvertToPcb: yes; FootprintName: R0805; Type: 厚膜电阻; Value: 1.5kΩ; Temperature Coefficient: ±100ppm/℃; Operating Temperature Range: -55℃~+155℃
R2 R5 R6 = 0805W8F5101T5E: 电阻类型:厚膜电阻;阻值:5.1kΩ;精度:±1%;功率:125mW;工作电压:150V;温度系数:±100ppm/℃;; Manufacturer: UNI-ROYAL(厚声); AddInBom: yes; ModelId: 37a81e68749a4138bd2dfa6897b24b850819f05c4eef4c71ace90d822a990e87; ModelName: R0805_L2.0-W1.3-H0.6; ModelTransform: 78.74,51.181,0,0,0,0,0,-0.0005,0; Tolerance: ±1%; Power(Watts): 125mW; Voltage-Supply(Max): 150V; Symbol: 0805W8F5101T5E; Device: 0805W8F5101T5E; LCSC Part Name: 5.1kΩ ±1% 125mW 厚膜电阻; SupplierPart: C27834; ManufacturerPart: 0805W8F5101T5E; Supplier Footprint: 0805; JLCPCB Part Class: Basic Part; Datasheet: https://item.szlcsc.com/datasheet/0805W8F5101T5E/28584.html; Supplier: LCSC; ConvertToPcb: yes; FootprintName: R0805; Type: 厚膜电阻; Value: 5.1kΩ; Temperature Coefficient: ±100ppm/℃; Operating Temperature: -55℃~+155℃
R3 R4 = 0805W8F1002T5E_C17414: 电阻类型:厚膜电阻;阻值:10kΩ;精度:±1%;功率:125mW;工作电压:150V;温度系数:±100ppm/℃;; Manufacturer: UNI-ROYAL(厚声); AddInBom: yes; ModelId: 37a81e68749a4138bd2dfa6897b24b850819f05c4eef4c71ace90d822a990e87; ModelName: R0805_L2.0-W1.3-H0.6; ModelTransform: 78.74,51.181,0,0,0,0,0,-0.0005,0; Tolerance: ±1%; Power(Watts): 125mW; Voltage-Supply(Max): 150V; Symbol: 0805W8F1002T5E; Device: 0805W8F1002T5E_C17414; LCSC Part Name: 10kΩ ±1% 125mW 厚膜电阻; SupplierPart: C17414; ManufacturerPart: 0805W8F1002T5E; Supplier Footprint: 0805; JLCPCB Part Class: Basic Part; Datasheet: https://item.szlcsc.com/datasheet/0805W8F1002T5E/18102.html; Supplier: LCSC; ConvertToPcb: yes; FootprintName: R0805; Type: 厚膜电阻; Value: 10kΩ; Temperature Coefficient: ±100ppm/℃; Operating Temperature: -55℃~+155℃
R7 R11 R14 R16 R35 = RT0805BRD07100KL: 电阻类型:薄膜电阻;阻值:100kΩ;精度:±0.1%;功率:125mW;最大工作电压:150V;温度系数:±25ppm/℃;; Manufacturer: YAGEO(国巨); 3D Model: 37a81e68749a4138bd2dfa6897b24b850819f05c4eef4c71ace90d822a990e87; 3D Model Transform: 78.74,51.181,0,0,0,0,0,-0.0005,0; Tolerance: ±0.1%; Power(Watts): 125mW; Overload Voltage (Max): 150V; AddInBom: yes; ModelName: R0805_L2.0-W1.3-H0.6; Symbol: RT0805BRD07100KL; Device: RT0805BRD07100KL; LCSC Part Name: 薄膜电阻 100kΩ ±0.1% 125mW; Supplier Part: C122537; Manufacturer Part: RT0805BRD07100KL; Supplier Footprint: 0805; JLCPCB Part Class: Extended Part; Datasheet: https://atta.szlcsc.com/upload/public/pdf/source/20170721/C122537_1500619325668834091.pdf; Supplier: LCSC; Type: 薄膜电阻; Value: 100kΩ; Temperature Coefficient: ±25ppm/℃; Operating Temperature Range: -55℃~+155℃; ConvertToPcb: yes; FootprintName: R0805
R8 = RT0805BRD07100KL: 电阻类型:薄膜电阻;阻值:100kΩ;精度:±0.1%;功率:125mW;最大工作电压:150V;温度系数:±25ppm/℃;; Manufacturer: YAGEO(国巨); AddInBom: yes; ModelId: 37a81e68749a4138bd2dfa6897b24b850819f05c4eef4c71ace90d822a990e87; ModelName: R0805_L2.0-W1.3-H0.6; ModelTransform: 78.74,51.181,0,0,0,0,0,-0.0005,0; Tolerance: ±0.1%; Power(Watts): 125mW; Overload Voltage (Max): 150V; Symbol: RT0805BRD07100KL; Device: RT0805BRD07100KL; LCSC Part Name: 薄膜电阻 100kΩ ±0.1% 125mW; SupplierPart: C122537; ManufacturerPart: RT0805BRD07100KL; Supplier Footprint: 0805; JLCPCB Part Class: Extended Part; Datasheet: https://atta.szlcsc.com/upload/public/pdf/source/20170721/C122537_1500619325668834091.pdf; Supplier: LCSC; ConvertToPcb: yes; FootprintName: R0805; Type: 薄膜电阻; Value: 100kΩ; Temperature Coefficient: ±25ppm/℃; Operating Temperature Range: -55℃~+155℃
R9 R10 = FRC0805J103TS: 电阻类型:厚膜电阻;阻值:10kΩ;精度:±5%;功率:125mW;工作电压:150V;温度系数:±100ppm/℃;; Manufacturer: FOJAN(富捷); AddInBom: yes; ModelId: 37a81e68749a4138bd2dfa6897b24b850819f05c4eef4c71ace90d822a990e87; ModelName: R0805_L2.0-W1.3-H0.6; ModelTransform: 78.74,51.181,0,0,0,0,0,-0.0005,0; Tolerance: ±5%; Power(Watts): 125mW; Voltage-Supply(Max): 150V; Symbol: FRC0805J103TS; Device: FRC0805J103TS; LCSC Part Name: 10kΩ ±5% 125mW 厚膜电阻; SupplierPart: C2930231; ManufacturerPart: FRC0805J103TS; Supplier Footprint: 0805; JLCPCB Part Class: Extended Part; Supplier: LCSC; ConvertToPcb: yes; FootprintName: R0805; Type: 厚膜电阻; Value: 10kΩ; Temperature Coefficient: ±100ppm/℃; Operating Temperature: -55℃~+155℃
R12 R13 R24 R28 R29 R32 R33 = FRC0805J103TS: 电阻类型:厚膜电阻;阻值:10kΩ;精度:±5%;功率:125mW;工作电压:150V;温度系数:±100ppm/℃;; Manufacturer: FOJAN(富捷); 3D Model: 37a81e68749a4138bd2dfa6897b24b850819f05c4eef4c71ace90d822a990e87; 3D Model Transform: 78.74,51.181,0,0,0,0,0,-0.0005,0; Tolerance: ±5%; Power(Watts): 125mW; Voltage-Supply(Max): 150V; AddInBom: yes; ModelName: R0805_L2.0-W1.3-H0.6; Symbol: FRC0805J103TS; Device: FRC0805J103TS; LCSC Part Name: 10kΩ ±5% 125mW 厚膜电阻; Supplier Part: C2930231; Manufacturer Part: FRC0805J103TS; Supplier Footprint: 0805; JLCPCB Part Class: Extended Part; Supplier: LCSC; Type: 厚膜电阻; Value: 10kΩ; Temperature Coefficient: ±100ppm/℃; Operating Temperature: -55℃~+155℃; ConvertToPcb: yes; FootprintName: R0805
R15 = FRC0805J472 TS: 电阻类型:厚膜电阻;阻值:4.7kΩ;精度:±5%;功率:125mW;工作电压:150V;温度系数:±100ppm/℃;; Manufacturer: FOJAN(富捷); AddInBom: yes; ModelId: 37a81e68749a4138bd2dfa6897b24b850819f05c4eef4c71ace90d822a990e87; ModelName: R0805_L2.0-W1.3-H0.6; ModelTransform: 78.74,51.181,0,0,0,0,0,-0.0005,0; Tolerance: ±5%; Power(Watts): 125mW; Voltage-Supply(Max): 150V; Symbol: FRC0805J472 TS; Device: FRC0805J472 TS; LCSC Part Name: 4.7kΩ ±5% 125mW 厚膜电阻; SupplierPart: C2907326; ManufacturerPart: FRC0805J472 TS; Supplier Footprint: 0805; JLCPCB Part Class: Extended Part; Supplier: LCSC; ConvertToPcb: yes; FootprintName: R0805; Type: 厚膜电阻; Value: 4.7kΩ; Temperature Coefficient: ±100ppm/℃; Operating Temperature: -55℃~+155℃
R17 = 0805W8F1501T5E: 电阻类型:厚膜电阻;阻值:1.5kΩ;精度:±1%;功率:125mW;最大工作电压:150V;温度系数:±100ppm/℃;; Manufacturer: UNI-ROYAL(厚声); 3D Model: 37a81e68749a4138bd2dfa6897b24b850819f05c4eef4c71ace90d822a990e87; 3D Model Transform: 78.74,51.181,0,0,0,0,0,-0.0005,0; Tolerance: ±1%; Power(Watts): 125mW; Overload Voltage (Max): 150V; AddInBom: yes; ModelName: R0805_L2.0-W1.3-H0.6; Symbol: 0805W8F1501T5E; Device: 0805W8F1501T5E; LCSC Part Name: 1.5kΩ ±1% 125mW 厚膜电阻; Supplier Part: C4310; Manufacturer Part: 0805W8F1501T5E; Supplier Footprint: 0805; JLCPCB Part Class: Basic Part; Datasheet: https://atta.szlcsc.com/upload/public/pdf/source/20200306/C422600_1E6D84923E4A46A82E41ADD87F860B5C.pdf; Supplier: LCSC; Type: 厚膜电阻; Value: 1.5kΩ; Temperature Coefficient: ±100ppm/℃; Operating Temperature Range: -55℃~+155℃; ConvertToPcb: yes; FootprintName: R0805
R18 = FRC0805F3301TS: 电阻类型:厚膜电阻;阻值:3.3kΩ;精度:±1%;功率:125mW;工作电压:150V;温度系数:±100ppm/℃;; Manufacturer: FOJAN(富捷); AddInBom: yes; ModelId: 37a81e68749a4138bd2dfa6897b24b850819f05c4eef4c71ace90d822a990e87; ModelName: R0805_L2.0-W1.3-H0.6; ModelTransform: 78.74,51.181,0,0,0,0,0,-0.0005,0; Tolerance: ±1%; Power(Watts): 125mW; Voltage-Supply(Max): 150V; Symbol: FRC0805F3301TS; Device: FRC0805F3301TS; LCSC Part Name: 3.3kΩ ±1% 125mW 厚膜电阻; SupplierPart: C2907249; ManufacturerPart: FRC0805F3301TS; Supplier Footprint: 0805; JLCPCB Part Class: Extended Part; Supplier: LCSC; ConvertToPcb: yes; FootprintName: R0805; Type: 厚膜电阻; Value: 3.3kΩ; Temperature Coefficient: ±100ppm/℃; Operating Temperature: -55℃~+155℃
R19 R20 = FRC0805J153 TS: 电阻类型:厚膜电阻;阻值:15kΩ;精度:±5%;功率:125mW;工作电压:150V;温度系数:±100ppm/℃;; Manufacturer: FOJAN(富捷); AddInBom: yes; ModelId: 37a81e68749a4138bd2dfa6897b24b850819f05c4eef4c71ace90d822a990e87; ModelName: R0805_L2.0-W1.3-H0.6; ModelTransform: 78.74,51.181,0,0,0,0,0,-0.0005,0; Tolerance: ±5%; Power(Watts): 125mW; Voltage-Supply(Max): 150V; Symbol: FRC0805J153 TS; Device: FRC0805J153 TS; LCSC Part Name: 15kΩ ±5% 125mW 厚膜电阻; SupplierPart: C2933528; ManufacturerPart: FRC0805J153 TS; Supplier Footprint: 0805; JLCPCB Part Class: Extended Part; Supplier: LCSC; ConvertToPcb: yes; FootprintName: R0805; Type: 厚膜电阻; Value: 15kΩ; Temperature Coefficient: ±100ppm/℃; Operating Temperature: -55℃~+155℃
R21 R22 = 0805W8J0473T5E: 电阻类型:厚膜电阻;阻值:47kΩ;精度:±5%;功率:125mW;工作电压:150V;温度系数:±100ppm/℃;; Manufacturer: UNI-ROYAL(厚声); AddInBom: yes; ModelId: 37a81e68749a4138bd2dfa6897b24b850819f05c4eef4c71ace90d822a990e87; ModelName: R0805_L2.0-W1.3-H0.6; ModelTransform: 78.74,51.181,0,0,0,0,0,-0.0005,0; Tolerance: ±5%; Power(Watts): 125mW; Voltage-Supply(Max): 150V; Symbol: 0805W8J0473T5E; Device: 0805W8J0473T5E; LCSC Part Name: 47kΩ ±5% 125mW 厚膜电阻; SupplierPart: C29252; ManufacturerPart: 0805W8J0473T5E; Supplier Footprint: 0805; JLCPCB Part Class: Extended Part; Datasheet: https://item.szlcsc.com/datasheet/0805W8J0473T5E/30004.html; Supplier: LCSC; ConvertToPcb: yes; FootprintName: R0805; Type: 厚膜电阻; Value: 47kΩ; Temperature Coefficient: ±100ppm/℃; Operating Temperature: -55℃~+155℃
R23 = RE0805FAR000: 电阻类型:合金电阻;阻值:0Ω;精度:±1%;功率:500mW;温度系数:±50ppm/℃;安装方式:贴片;; Manufacturer: JIERR(捷而瑞); AddInBom: yes; ModelId: 37a81e68749a4138bd2dfa6897b24b850819f05c4eef4c71ace90d822a990e87; ModelName: R0805_L2.0-W1.3-H0.6; ModelTransform: 78.74,51.181,0,0,0,0,0,-0.0005,0; Tolerance: ±1%; Power(Watts): 500mW; Symbol: RE0805FAR000; Device: RE0805FAR000; LCSC Part Name: 0Ω 0.5W 0805 ±1%; SupplierPart: C51934133; ManufacturerPart: RE0805FAR000; Supplier Footprint: 0805; JLCPCB Part Class: Extended Part; Datasheet: https://item.szlcsc.com/datasheet/RE0805FAR000/54649545.html; Supplier: LCSC; ConvertToPcb: yes; FootprintName: R0805; Type: 合金电阻; Value: 0Ω; Temperature Coefficient: ±50ppm/℃; Mounting Type: 贴片
R25 R26 = FRC0805F1000TS: 电阻类型:厚膜电阻;阻值:100Ω;精度:±1%;功率:125mW;工作电压:150V;温度系数:±100ppm/℃;; Manufacturer: FOJAN(富捷); AddInBom: yes; ModelId: 37a81e68749a4138bd2dfa6897b24b850819f05c4eef4c71ace90d822a990e87; ModelName: R0805_L2.0-W1.3-H0.6; ModelTransform: 78.74,51.181,0,0,0,0,0,-0.0005,0; Tolerance: ±1%; Power(Watts): 125mW; Voltage-Supply(Max): 150V; Symbol: FRC0805F1000TS; Device: FRC0805F1000TS; LCSC Part Name: 100Ω ±1% 125mW 厚膜电阻; SupplierPart: C2907218; ManufacturerPart: FRC0805F1000TS; Supplier Footprint: 0805; JLCPCB Part Class: Extended Part; Supplier: LCSC; ConvertToPcb: yes; FootprintName: R0805; Type: 厚膜电阻; Value: 100Ω; Temperature Coefficient: ±100ppm/℃; Operating Temperature: -55℃~+155℃
R27 = JER33X-1-14: 阻值:10kΩ;精度:±25%;功率:150mW;温度系数:±250ppm/℃;; Manufacturer: JIERR(捷而瑞); AddInBom: yes; ModelId: de65341884c4454393239133889d31970819f05c4eef4c71ace90d822a990e87; ModelTransform: 120.4722,150,0,0,0,0,0,0,0; Tolerance: ±25%; Power(Watts): 150mW; Number of Turns: 1; Symbol: JER33X-1-14; Device: JER33X-1-14; LCSC Part Name: 玻璃釉贴片电位器; SupplierPart: C48997896; ManufacturerPart: JER33X-1-14; Supplier Footprint: SMD-3P,3.4x3.1mm; JLCPCB Part Class: Extended Part; Datasheet: https://item.szlcsc.com/datasheet/JER33X-1-14/51342032.html; Supplier: LCSC; ConvertToPcb: yes; FootprintName: RES-ADJ-SMD_JER33X-1-14; ModelName: RES-ADJ-SMD_JER33X-1-14; Value: 10kΩ; Temperature Coefficient: ±250ppm/℃
R30 R31 = 0805W8J0473T5E: 电阻类型:厚膜电阻;阻值:47kΩ;精度:±5%;功率:125mW;工作电压:150V;温度系数:±100ppm/℃;; Manufacturer: UNI-ROYAL(厚声); 3D Model: 37a81e68749a4138bd2dfa6897b24b850819f05c4eef4c71ace90d822a990e87; 3D Model Transform: 78.74,51.181,0,0,0,0,0,-0.0005,0; Tolerance: ±5%; Power(Watts): 125mW; Voltage-Supply(Max): 150V; AddInBom: yes; ModelName: R0805_L2.0-W1.3-H0.6; Symbol: 0805W8J0473T5E; Device: 0805W8J0473T5E; LCSC Part Name: 47kΩ ±5% 125mW 厚膜电阻; Manufacturer Part: 0805W8J0473T5E; Supplier Footprint: 0805; JLCPCB Part Class: Extended Part; Datasheet: https://item.szlcsc.com/datasheet/0805W8J0473T5E/30004.html; Supplier: LCSC; Type: 厚膜电阻; Temperature Coefficient: ±100ppm/℃; Operating Temperature: -55℃~+155℃; ConvertToPcb: yes; FootprintName: R0805
  R30: Supplier Part: C29252; Value: 47kΩ
  R31: Value: 0Ω
R34 = RE0805FAR000: 电阻类型:合金电阻;阻值:0Ω;精度:±1%;功率:500mW;温度系数:±50ppm/℃;安装方式:贴片;; Manufacturer: JIERR(捷而瑞); 3D Model: 37a81e68749a4138bd2dfa6897b24b850819f05c4eef4c71ace90d822a990e87; 3D Model Transform: 78.74,51.181,0,0,0,0,0,-0.0005,0; Tolerance: ±1%; Power(Watts): 500mW; AddInBom: yes; ModelName: R0805_L2.0-W1.3-H0.6; Symbol: RE0805FAR000; Device: RE0805FAR000; LCSC Part Name: 0Ω 0.5W 0805 ±1%; Supplier Part: C51934133; Manufacturer Part: RE0805FAR000; Supplier Footprint: 0805; JLCPCB Part Class: Extended Part; Datasheet: https://item.szlcsc.com/datasheet/RE0805FAR000/54649545.html; Supplier: LCSC; Type: 合金电阻; Value: 0Ω; Temperature Coefficient: ±50ppm/℃; Mounting Type: 贴片; ConvertToPcb: yes; FootprintName: R0805
R36 = RT0805BRD071KL: 电阻类型:薄膜电阻;阻值:1kΩ;精度:±0.1%;功率:125mW;最大工作电压:150V;温度系数:±25ppm/℃;; Manufacturer: YAGEO(国巨); AddInBom: yes; ModelId: 37a81e68749a4138bd2dfa6897b24b850819f05c4eef4c71ace90d822a990e87; ModelName: R0805_L2.0-W1.3-H0.6; ModelTransform: 78.74,51.181,0,0,0,0,0,-0.0005,0; Tolerance: ±0.1%; Power(Watts): 125mW; Overload Voltage (Max): 150V; Symbol: RT0805BRD071KL; Device: RT0805BRD071KL; LCSC Part Name: 薄膜电阻 1kΩ ±0.1% 125mW; SupplierPart: C110774; ManufacturerPart: RT0805BRD071KL; Supplier Footprint: 0805; JLCPCB Part Class: Extended Part; Datasheet: https://atta.szlcsc.com/upload/public/pdf/source/20171026/C133380_15089840010201058857.pdf; Supplier: LCSC; ConvertToPcb: yes; FootprintName: R0805; Type: 薄膜电阻; Value: 1kΩ; Temperature Coefficient: ±25ppm/℃; Operating Temperature Range: -55℃~+155℃
SW1 SW2 = SH-6X6X4.3H-CJ: 电路结构:单刀单掷;按钮形状:圆形按钮;作用力:2.5N;安装方式:直插;开关长度:6mm;开关宽度:6mm;开关高度:4.3mm;带支架:不带支架;触点电流:50mA;额定电压:12V;带灯:无;工作寿命:10万次;; Manufacturer: SHOU HAN(首韩); AddInBom: yes; ModelId: 7465a1c6ddb3456bb37faad11a123e5a0819f05c4eef4c71ace90d822a990e87; ModelTransform: 236.22,307.086,0,90,0,0,0,0,-137.795; Circuit: 单刀单掷; Actuator Style: 圆形按钮; Operating Force: 2.5N; Switch Height: 4.3mm; with Bracket: 不带支架; Contact Current: 50mA; Voltage Rating: 12V; Actuator/Cap Color: 黑色; With Lamp: 无; Life: 10万次; Symbol: SH-6X6X4.3H-CJ; Device: SH-6X6X4.3H-CJ; LCSC Part Name: 6*6/6x6 轻触开关; SupplierPart: C42416242; ManufacturerPart: SH-6X6X4.3H-CJ; Supplier Footprint: DIP-4P,6x6mm; JLCPCB Part Class: Extended Part; Datasheet: https://item.szlcsc.com/datasheet/SH-6X6X4.3H-CJ/44415289.html; Supplier: LCSC; ConvertToPcb: yes; FootprintName: SW-TH_SH-6X6X4.3H-CJ; ModelName: SW-TH_SH-6X6X4.3H-CJ; Mounting Type: 直插; Length: 6mm; Width: 6mm; Termination Style: PC引脚; Operating Temperature: -25℃~+70℃
U1 = TMCP1A106MTRF: 容值:10uF;精度:±20%;额定电压:10V;等效串联电阻:5.9Ω@100kHz;; Manufacturer: VISHAY(威世); AddInBom: yes; ModelId: 1f26856de1634853a779dc49a005d0a10819f05c4eef4c71ace90d822a990e87; ModelTransform: 78.74,49.2125,0,0,0,0,0,-0.551,0; Tolerance: ±20%; Rated Voltage: 10V; Symbol: TMCP1A106MTRF; Device: TMCP1A106MTRF; LCSC Part Name: 10uF ±20% 10V; SupplierPart: C1969735; ManufacturerPart: TMCP1A106MTRF; Supplier Footprint: 0805; JLCPCB Part Class: Extended Part; Datasheet: https://atta.szlcsc.com/upload/public/pdf/source/20210506/EB7F77920409F8D63FFE94178A7159DC.pdf; Supplier: LCSC; ConvertToPcb: yes; FootprintName: CAP-SMD_L2.0-W1.3-FD; ModelName: CAP-SMD_L2.0-W1.3-FD; Value: 10uF; Leakage Current(DCL): -; Ripple Current: -; Equivalent Series Resistance(ESR): 5.9Ω@100kHz; Operating Temperature: -55℃~+125℃
U2 = AMS1117-3.3_C6186: 输出类型:固定;工作电压:15V;输出电压:3.3V;输出电流:1A;电源纹波抑制比(PSRR):72dB@(120Hz);输出极性:正极;; Manufacturer: AMS; AddInBom: yes; ModelId: 925194bf9823436183a3e0b978a8d0760819f05c4eef4c71ace90d822a990e87; ModelName: SOT-223-4P_L6.5-W3.5-H1.6-LS7.0-P2.30; ModelTransform: 279.89794,255.905,0,180,0,0,-3.9385,-0.0005,0; Output Type: 固定; Voltage - Supply: 15V; Output Voltage: 3.3V; Output Current: 1A; Voltage Dropout: 1.1V@(800mA); standby current: 5mA; Noise: 0.003%Vout; Output Configuration: 正极; Number of Outputs: 1; Symbol: AMS1117-3.3; Device: AMS1117-3.3_C6186; LCSC Part Name: 3.3V 1A 15V; SupplierPart: C6186; ManufacturerPart: AMS1117-3.3; Supplier Footprint: SOT-223; JLCPCB Part Class: Basic Part; Datasheet: https://item.szlcsc.com/datasheet/AMS1117-3.3/6652.html; Supplier: LCSC; ConvertToPcb: yes; FootprintName: SOT-223-3_L6.5-W3.4-P2.30-LS7.0-BR; Power Supply Rejection Ratio (PSRR): 72dB@(120Hz); Features: 过流保护；热关断; Operating Temperature: -40℃~+125℃
U3 = STM32F411RET6: CPU内核:ARM-M4;CPU最大主频:100MHz;应用领域:-;; Manufacturer: ST(意法半导体); AddInBom: yes; ModelId: cd9de06618c44fcf82654c43a457f83c0819f05c4eef4c71ace90d822a990e87; ModelName: LQFP-64_L10.0-W10.0-H1.4-LS12.0-P0.50; ModelTransform: 472.441,472.441,0,0,0,0,0,0.465,0; CPU Core: ARM-M4; CPU Maximum Speed: 100MHz; Program Storage Size: 512KB; Program Memory Type: FLASH; Number of I/O: 50; ADC (Bit): 12bit; Voltage - Supply: 1.7V~3.6V; Symbol: STM32F411RET6; Device: STM32F411RET6; LCSC Part Name: 带DSP和FPU的高性能基本型系列ARM Cortex-M4 MCU，具有512 KB Flash、100 MHz CPU和ART加速器; SupplierPart: C94355; ManufacturerPart: STM32F411RET6; Supplier Footprint: LQFP-64(10x10); JLCPCB Part Class: Extended Part; Datasheet: https://item.szlcsc.com/datasheet/STM32F411RET6/95553.html; Supplier: LCSC; ConvertToPcb: yes; FootprintName: LQFP-64_L10.0-W10.0-P0.50-LS12.0-BL; Applications: -
U4 = 2N7002K_C22379475: 数量:1个N沟道;漏源电压(Vdss):60V;连续漏极电流(Id):340mA;导通电阻(RDS(on)):900mΩ@10V；1.1Ω@4.5V;耗散功率(Pd):350mW;阈值电压(Vgs(th)):1.3V@1.0mA;; Manufacturer: R+O(宏嘉诚); AddInBom: yes; ModelId: c62791f0466c4ae2a892c056b845b0ca0819f05c4eef4c71ace90d822a990e87; ModelName: SOT-23-3P_L2.9-W1.3-H1.0-LS2.4-P0.95; ModelTransform: 98.425,114.173,0,180,0,0,0.0005,-0.0005,0; Number: 1个N沟道; Drain to Source Voltage: 60V; Current - Continuous Drain(Id): 340mA; Pd - Power Dissipation: 350mW; Input Capacitance(Ciss): 40pF@10V; Reverse Transfer Capacitance (Crss@Vds): 10pF@10V; Symbol: 2N7002K_C22379475; Device: 2N7002K_C22379475; LCSC Part Name: 1个N沟道 耐压:60V 电流:340mA; SupplierPart: C22379475; ManufacturerPart: 2N7002K; Supplier Footprint: SOT-23; JLCPCB Part Class: Extended Part; Datasheet: https://item.szlcsc.com/datasheet/2N7002K/23902955.html; Supplier: LCSC; ConvertToPcb: yes; FootprintName: SOT-23-3_L2.9-W1.3-P0.95-LS2.4-BR; RDS(on): 900mΩ@10V；1.1Ω@4.5V; Gate Threshold Voltage (Vgs(th)): 1.3V@1.0mA; Gate Charge(Qg): -; Operating Temperature: -55℃~+150℃; Configuration: -; Type: N沟道
U5 = MCP6004T-I/ST: 放大器数:4;轨到轨:轨到轨输入,轨到轨输出;增益带宽积(GBW):1MHz;输入失调电压(Vos):4.5mV;压摆率(SR):600V/ms;输入偏置电流(Ib):1pA;; Manufacturer: MICROCHIP(美国微芯); Relevance: []; AddInBom: yes; ModelId: 02f1f60386074b2ca8e111040ac061f20819f05c4eef4c71ace90d822a990e87; ModelName: TSSOP-14_L5.0-W4.4-H1.0-LS6.4-P0.65; ModelTransform: 237.007,196.85,0,90,0,0,0,0,0; Number of Channels: 4; Maximum Power Supply Range (Vdd-Vss): 7V; Gain Bandwidth Product: 1MHz; Vos - Input Offset Voltage: 4.5mV; Input Offset Voltage Drift(Vos TC): 2uV/℃; Ib - Input Bias Current: 1pA; Input Voltage Noise Density: 28nV/√Hz@1kHz; Common Mode Rejection Ratio(CMRR): 76dB; Quiescent Current: 100uA; Output Current: 23mA; Single supply: 1.8V~5.5V; Symbol: MCP6004T-I/ST; Device: MCP6004T-I/ST; LCSC Part Name: 1 MHz低功率运算放大器; SupplierPart: C50282; ManufacturerPart: MCP6004T-I/ST; Supplier Footprint: TSSOP-14; JLCPCB Part Class: Extended Part; Datasheet: https://item.szlcsc.com/datasheet/MCP6004T-I%252FST/51291.html; Supplier: LCSC; ConvertToPcb: yes; FootprintName: TSSOP-14_L5.0-W4.4-P0.65-LS6.4-BL; Rail to Rail: 轨到轨输入,轨到轨输出; Slew Rate: 600V/ms; Input Offset Current(Ios): 1pA; Input offset current drift(Ios TC): -; Operating Temperature: -40℃~+125℃; Dual Supply: -; Features: -
U6 = HGC0805R5106K350NSLJ: 容值:10uF;精度:±10%;额定电压:35V;温度系数:X5R;; Manufacturer: Chinocera(华瓷); AddInBom: yes; ModelId: 1ba041120af144c991958decab20d2410819f05c4eef4c71ace90d822a990e87; ModelName: C0805_L2.0-W1.3-H1.3; ModelTransform: 78.74,51.181,0,0,0,0,0,0.0005,0; Tolerance: ±10%; Voltage Rating: 35V; Temperature Coefficient: X5R; Symbol: HGC0805R5106K350NSLJ; Device: HGC0805R5106K350NSLJ; LCSC Part Name: 10uF ±10% 35V; SupplierPart: C33546007; ManufacturerPart: HGC0805R5106K350NSLJ; Supplier Footprint: 0805; JLCPCB Part Class: Extended Part; Datasheet: https://item.szlcsc.com/datasheet/HGC0805R5106K350NSLJ/35278485.html; Supplier: LCSC; ConvertToPcb: yes; FootprintName: C0805; Value: 10uF
U7 = MCP6001T-I/OT: 放大器数:1;轨到轨:轨到轨输入,轨到轨输出;增益带宽积(GBW):1MHz;输入失调电压(Vos):4.5mV;压摆率(SR):600V/ms;输入偏置电流(Ib):1pA;; Manufacturer: MICROCHIP(美国微芯); AddInBom: yes; ModelId: 0a2a1b8f50944f73965918ad6e5fe1670819f05c4eef4c71ace90d822a990e87; ModelName: SOT-23-5_L2.9-W1.6-H1.1-LS2.8-P0.95; ModelTransform: 114.173,109.636,0,180,0,0,0,0,0; Number of Channels: 1; Maximum Power Supply Range (Vdd-Vss): 6V; Gain Bandwidth Product: 1MHz; Vos - Input Offset Voltage: 4.5mV; Input Offset Voltage Drift(Vos TC): 2uV/℃; Ib - Input Bias Current: 1pA; Input Voltage Noise Density: 28nV/√Hz@1kHz; Common Mode Rejection Ratio(CMRR): 76dB; Quiescent Current: 100uA; Output Current: 23mA; Single supply: 1.8V~6V; Symbol: MCP6001T-I/OT; Device: MCP6001T-I/OT; LCSC Part Name: 1 MHz 低功耗运算放大器; SupplierPart: C116490; ManufacturerPart: MCP6001T-I/OT; Supplier Footprint: SOT-23-5; JLCPCB Part Class: Extended Part; Datasheet: https://item.szlcsc.com/datasheet/MCP6001T-I%252FOT/117744.html; Supplier: LCSC; ConvertToPcb: yes; FootprintName: SOT-23-5_L3.0-W1.7-P0.95-LS2.8-BR; Rail to Rail: 轨到轨输入,轨到轨输出; Slew Rate: 600V/ms; Input Offset Current(Ios): 1pA; Input offset current drift(Ios TC): -; Operating Temperature: -40℃~+85℃; Dual Supply: -; Features: -